# EAGLE design servoreference (EAGLE 6.0)
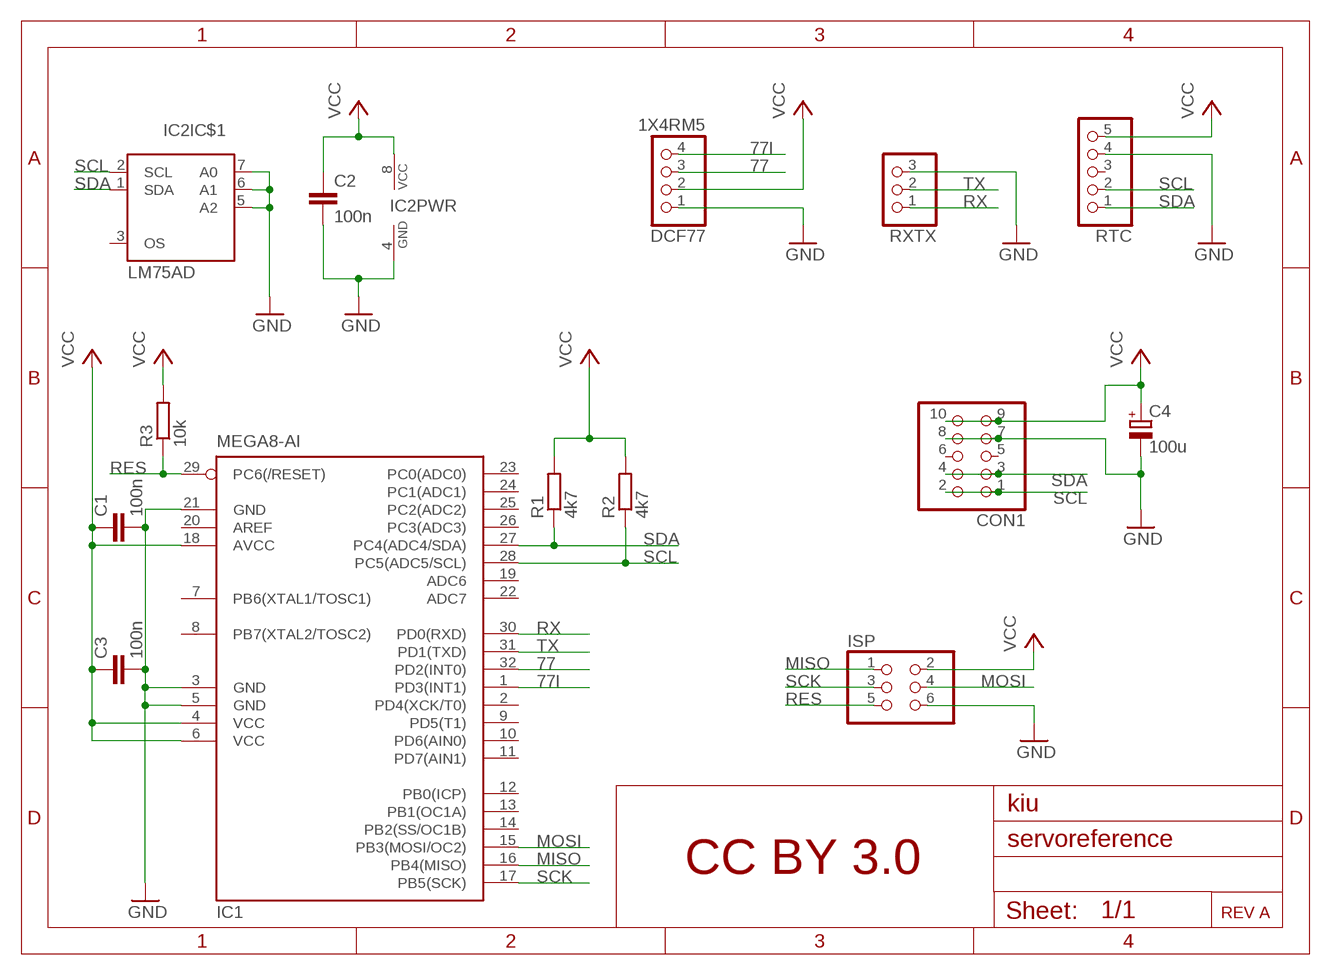
[diagram p0: schematic, sheet 1]

## Parts
C1  100n  C-EUC0805  [C0805]
C2  100n  C-EUC0805  [C0805]
C3  100n  C-EUC0805  [C0805]
C4  100u  CPOL-EU153CLV-0505  [153CLV-0505]
CON1  PINHD-2X5  [2X05]
DCF77  1X4RM5  [1X4RM5]
IC1  MEGA8-AI  [TQFP32-08]
IC2  LM75AD  [SO08]
ISP  PINHD-2X3  [2X03]
R1  4k7  R-EU_R0805  [R0805]
R2  4k7  R-EU_R0805  [R0805]
R3  10k  R-EU_R0805  [R0805]
RTC  PINHD-1X5  [1X05]
RXTX  PINHD-1X3  [1X03]

## Nets
77: DCF77.3 IC1.32(PD2(INT0))
77I: DCF77.4 IC1.1(PD3(INT1))
GND: C1.2 C2.2 C3.2 C4.- CON1.7 CON1.8 DCF77.1 IC1.3(GND) IC1.5(GND) IC1.21(GND) IC2.4(PWR:GND) IC2.5(IC$1:A2) IC2.6(IC$1:A1) IC2.7(IC$1:A0) ISP.6 RTC.4 RXTX.3
MISO: IC1.16(PB4(MISO)) ISP.1
MOSI: IC1.15(PB3(MOSI/OC2)) ISP.4
RES: IC1.29(PC6(/RESET)) ISP.5 R3.1
RX: IC1.30(PD0(RXD)) RXTX.1
SCK: IC1.17(PB5(SCK)) ISP.3
SCL: CON1.1 CON1.2 IC1.28(PC5(ADC5/SCL)) IC2.2(IC$1:SCL) R2.1 RTC.2
SDA: CON1.3 CON1.4 IC1.27(PC4(ADC4/SDA)) IC2.1(IC$1:SDA) R1.1 RTC.1
TX: IC1.31(PD1(TXD)) RXTX.2
VCC: C1.1 C2.1 C3.1 C4.+ CON1.9 CON1.10 DCF77.2 IC1.4(VCC) IC1.6(VCC) IC1.18(AVCC) IC2.8(PWR:VCC) ISP.2 R1.2 R2.2 R3.2 RTC.5
Unconnected: CON1.5 CON1.6 IC1.2(PD4(XCK/T0)) IC1.7(PB6(XTAL1/TOSC1)) IC1.8(PB7(XTAL2/TOSC2)) IC1.9(PD5(T1)) IC1.10(PD6(AIN0)) IC1.11(PD7(AIN1)) IC1.12(PB0(ICP)) IC1.13(PB1(OC1A)) IC1.14(PB2(SS/OC1B)) IC1.19(ADC6) IC1.20(AREF) IC1.22(ADC7) IC1.23(PC0(ADC0)) IC1.24(PC1(ADC1)) IC1.25(PC2(ADC2)) IC1.26(PC3(ADC3)) IC2.3(IC$1:OS) RTC.3

## Notes on the sheet
- kiu
- CC BY 3.0
- REV A

## Library data of the parts
C1-C3 = rcl:C-EU: CAPACITOR, European symbol
C4 = rcl:CPOL-EU: POLARIZED CAPACITOR, European symbol
CON1 = pinhead:PINHD-2X5: PIN HEADER
DCF77 = kiu:1X4RM5
IC1 = atmel:MEGA8: MICROCONTROLLER 8 Kbytes FLASH, 1 kbytes SRAM, 512 bytes EEPROM, USART, 6-channel 10 bit ADC, 2-channel 8 bit ADC Pin compatible with Atmega48, ATMega88, ATMega168 Source: avr.lbr; MPN: ATMEGA8-16AU; OC_FARNELL: 9171371; OC_NEWARK: 73M8863
IC2 = i2c:LM75AD: Digital Temperature Sensor and Thermal Watchdog
ISP = pinhead:PINHD-2X3: PIN HEADER
R1-R3 = rcl:R-EU_: RESISTOR, European symbol
RTC = pinhead:PINHD-1X5: PIN HEADER
RXTX = pinhead:PINHD-1X3: PIN HEADER

## Board
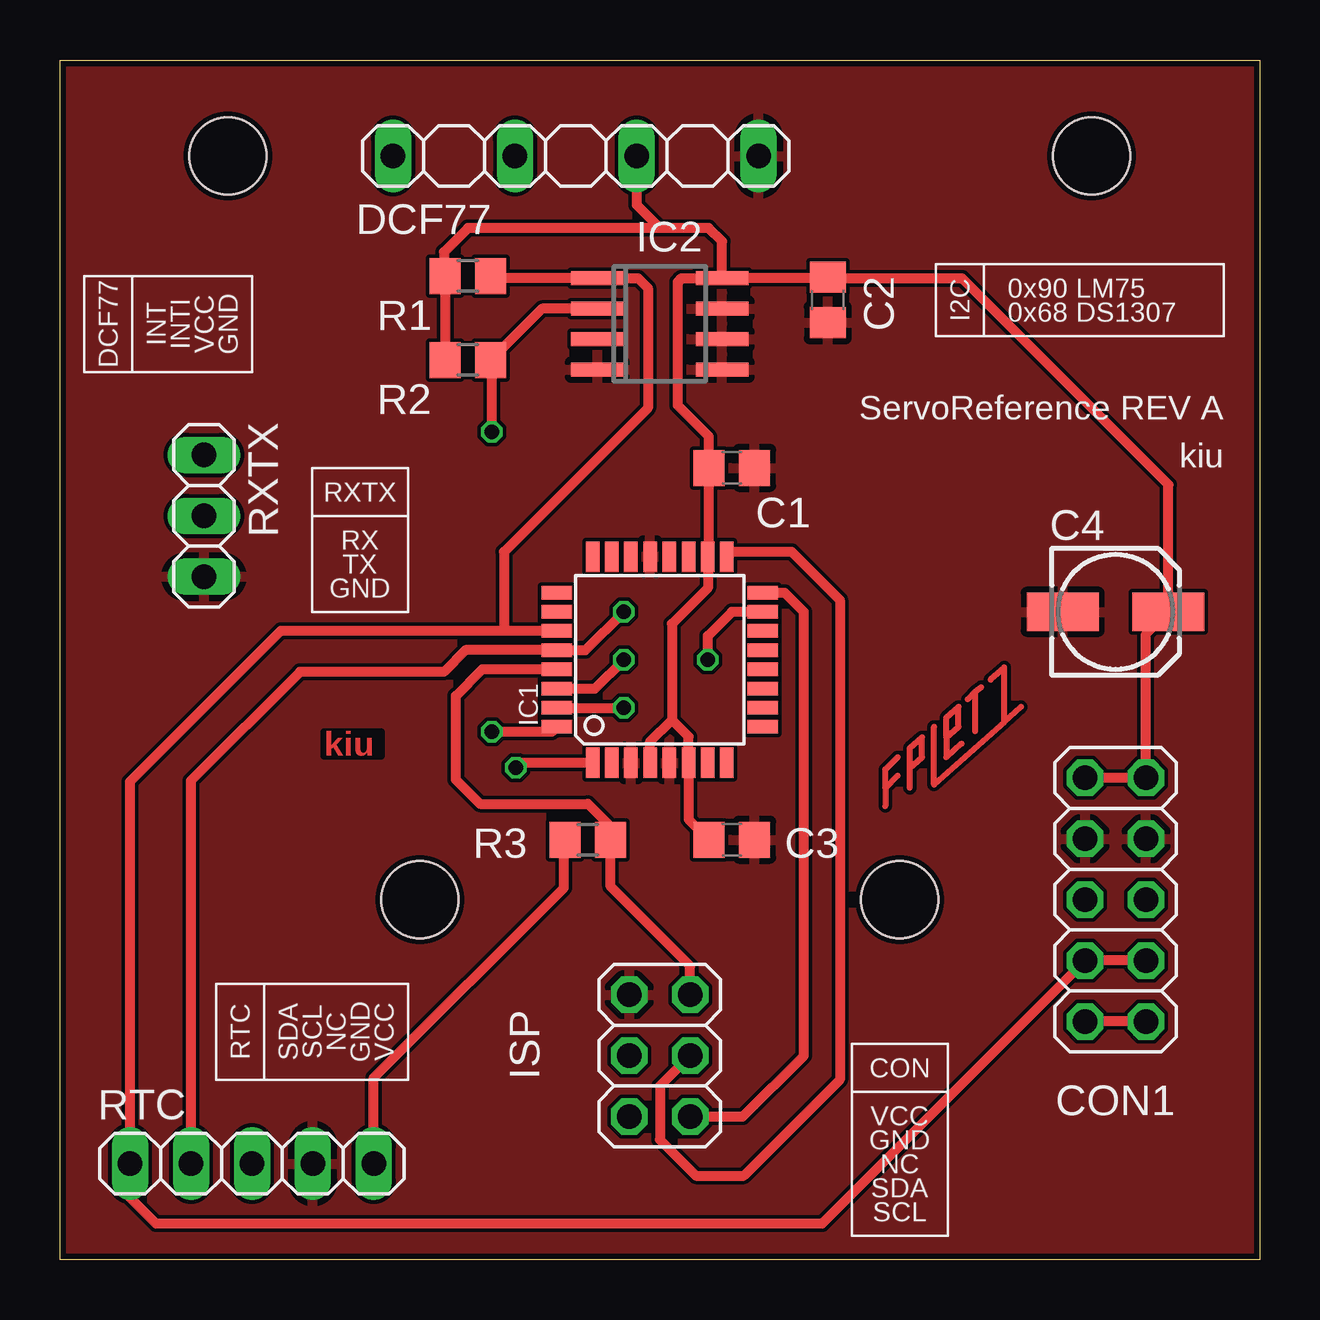
[diagram p1: board, top side]
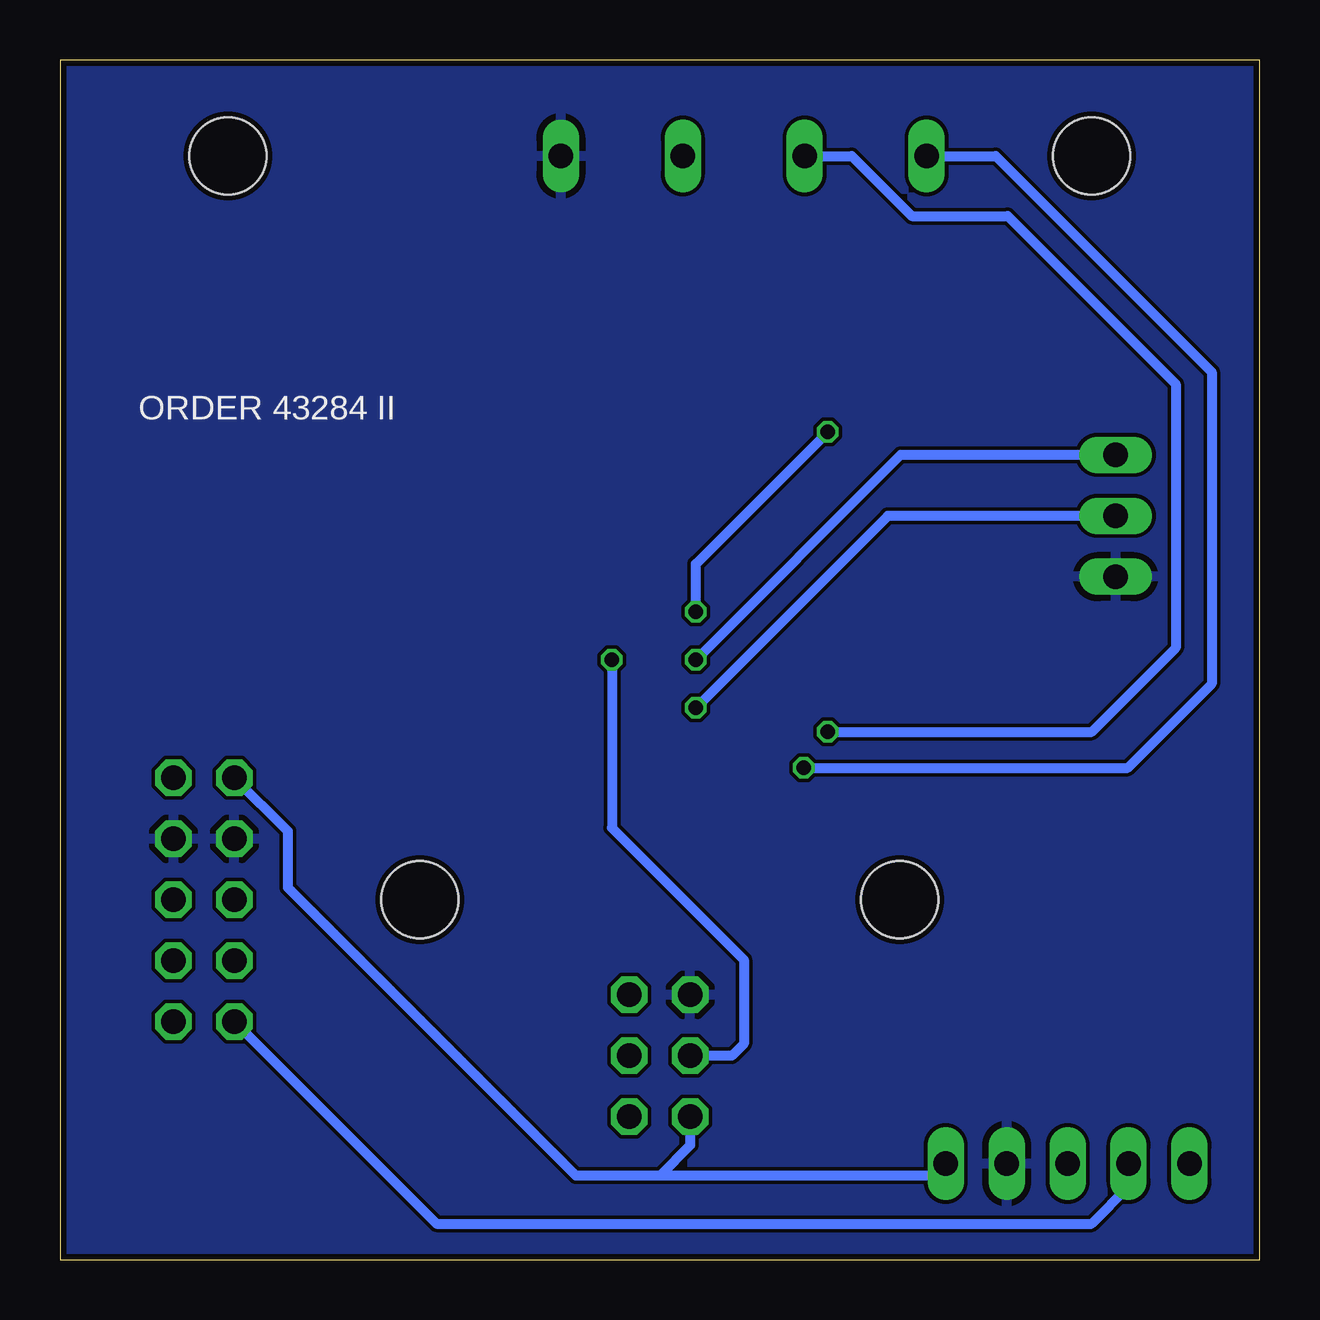
[diagram p2: board, bottom side, seen from below]

Size 50 x 50 mm. Coordinates in mm from the lower left corner, seen from the top.
Outline: 0,0 0,50 50,50 50,0 0,0
Copper layers (1*16): Top 0.035mm / dielectric 1.5mm / Bottom 0.035mm
Design rules: minimum track width 6mil, minimum drill 12mil, track to track 6mil, track to pad 6mil, pad to pad 6mil, via to via 6mil, smd to smd 0mil, copper to edge 10mil, drill to drill 10mil, minimum pad ring 10mil, minimum via ring 6mil, stop-mask expansion 2mil, vias tented up to drill 100mil, thermal gap 10mil
Holes 3.2 mm at 7,46 15,15 43,46 35,15

### Footprints (pad centres in the part's own frame; a part is rotated, then mirrored left to right if it is on the bottom)
C0805 = smd 1.3 x 1.5: 1 -0.95,0; 2 0.95,0
153CLV-0505 = smd 3 x 1.6: + 2.2,0; - -2.2,0
2X05 = drill 1.016 octagon: 1 -5.08,-1.27; 2 -5.08,1.27; 3 -2.54,-1.27; 4 -2.54,1.27; 5 0,-1.27; 6 0,1.27; 7 2.54,-1.27; 8 2.54,1.27; 9 5.08,-1.27; 10 5.08,1.27
1X4RM5 = drill 1.016 long: 1 -7.62,0; 2 -2.54,0; 3 2.54,0; 4 7.62,0
TQFP32-08 = smd 1.27 x 0.559: 1 -4.293,2.8; 2 -4.293,2; 3 -4.293,1.2; 4 -4.293,0.4; 5 -4.293,-0.4; 6 -4.293,-1.2; 7 -4.293,-2; 8 -4.293,-2.8; 17 4.293,-2.8; 18 4.293,-2; 19 4.293,-1.2; 20 4.293,-0.4; 21 4.293,0.4; 22 4.293,1.2; 23 4.293,2; 24 4.293,2.8 | smd 0.559 x 1.27: 9 -2.8,-4.293; 10 -2,-4.293; 11 -1.2,-4.293; 12 -0.4,-4.293; 13 0.4,-4.293; 14 1.2,-4.293; 15 2,-4.293; 16 2.8,-4.293; 25 2.8,4.293; 26 2,4.293; 27 1.2,4.293; 28 0.4,4.293; 29 -0.4,4.293; 30 -1.2,4.293; 31 -2,4.293; 32 -2.8,4.293
SO08 = smd 0.6 x 2.2: 1 -1.905,-2.6; 2 -0.635,-2.6; 3 0.635,-2.6; 4 1.905,-2.6; 5 1.905,2.6; 6 0.635,2.6; 7 -0.635,2.6; 8 -1.905,2.6
2X03 = drill 1.016 octagon: 1 -2.54,-1.27; 2 -2.54,1.27; 3 0,-1.27; 4 0,1.27; 5 2.54,-1.27; 6 2.54,1.27
R0805 = smd 1.3 x 1.5: 1 -0.95,0; 2 0.95,0
1X05 = drill 1.016 long: 1 -5.08,0; 2 -2.54,0; 3 0,0; 4 2.54,0; 5 5.08,0
1X03 = drill 1.016 long: 1 -2.54,0; 2 0,0; 3 2.54,0

### Placement (x,y rotation side)
C1  28,33 0 top
C2  32,40 270 top
C3  28,17.5 0 top
C4  44,27 0 top
CON1  44,15 90 top
DCF77  21.5,46 180 top
IC1  25,25 90 top
IC2  25,39 270 top
ISP  25,8.5 90 top
R1  17,41 180 top
R2  17,37.5 180 top
R3  22,17.5 180 top
RTC  8,4 0 top
RXTX  6,31 270 top

### Tracks (layer width: path | path; a pad name or v marks a point on that pad's centre or on a via)
77  (via drill 0.6)
  Top 0.406: IC1.32 20.51,22 v18,22
  Bottom 0.406: v18,22 7,22 3.5,25.5 3.5,36.5 10.5,43.5 14.5,43.5 17,46 DCF77.3
77I  (via drill 0.6)
  Top 0.406: IC1.1 19.29,20.71 v19,20.5
  Bottom 0.406: v19,20.5 5.5,20.5 2,24 2,37 11,46 DCF77.4
GND
  pour Top: -1,-1 51,-1 51,51 -1,51
  pour Bottom: -1,-1 51,-1 51,51 -1,51
MISO
  Top 0.406: IC1.16 30.2,27.8 31,27 31,8.5 28.46,5.96 ISP.1
MOSI  (via drill 0.6)
  Top 0.406: v27,25 27,26 28,27 IC1.15
  Bottom 0.406: v27,25 27,18 21.5,12.5 21.5,9 22,8.5 ISP.4
N$13
  Top 0.254: 35.42,20.49 35.42,21.32 35.93,21.76 35.93,20.94 35.42,20.49 | 35.42,19.67 35.42,20.49
N$14
  Top 0.254: 36.44,22.21 36.44,19.79 39.36,22.4 | 38.79,24.18 39.36,24.68 39.36,22.4 | 39.36,22.4 40.06,23.03
N$15
  Top 0.254: 37.58,21.51 36.94,20.94 36.94,21.76 | 36.94,21.76 36.94,22.59 37.45,23.03 37.45,22.21 36.94,21.76
N$16
  Top 0.254: 38.15,23.67 37.83,23.35 | 38.15,22.02 38.15,23.67 | 38.15,23.67 38.41,23.86
N$19
  Top 0.254: 34.91,20.94 34.4,20.43 34.4,19.67 | 34.4,19.67 34.4,18.9 | 34.4,19.67 34.91,20.17
RES
  Top 0.406: IC1.29 17.6,24.6 16.5,23.5 16.5,20 17.5,19 22,19 22.95,18.05 R3.1 22.95,15.55 26.27,12.23 ISP.5
RX  (via drill 0.6)
  Top 0.406: IC1.30 22.3,23.8 v23.5,25
  Bottom 0.406: v23.5,25 14.96,33.54 RXTX.1
SCK
  Top 0.406: ISP.3 25,7.23 25,5 26.5,3.5 28.5,3.5 32.5,7.5 32.5,27.5 30.5,29.5 28.01,29.5 IC1.17
SCL  (via drill 0.6)
  Top 0.406: CON1.1 CON1.2 | IC2.2 20.09,39.63 R2.1 18,37.45 v18,34.5 | v23.5,27 21.9,25.4 IC1.28 16.9,25.4 16,24.5 10,24.5 5.46,19.96 RTC.2
  Bottom 0.406: CON1.2 34.31,1.5 7,1.5 5.46,3.04 RTC.2 | v23.5,27 23.5,29 v18,34.5
SDA
  Top 0.406: CON1.3 CON1.4 31.77,1.5 4,1.5 2.92,2.58 RTC.1 2.92,19.92 9.2,26.2 18.5,26.2 | R1.1 18.05,40.91 IC2.1 24.09,40.91 24.5,40.5 24.5,35.5 18.5,29.5 18.5,26.2 | IC1.27 18.5,26.2
TX  (via drill 0.6)
  Top 0.406: IC1.31 v23.5,23
  Bottom 0.406: v23.5,23 15.5,31 RXTX.2
VCC
  Top 0.406: 31.95,40.91 C2.1 | IC2.8 27.6,42.44 27.04,43 25,43 | 31.95,40.91 IC2.8 | IC1.4 24.6,21.6 25.5,22.5 | R2.2 R1.2 16,41.05 16,42 17,43 25,43 | CON1.10 CON1.9 45.27,26.07 C4.+ 46.2,32.3 37.59,40.91 31.95,40.91 | 25.5,22.5 25.5,26.5 27,28 IC1.18 27.05,29.34 C1.1 27.05,34.3 25.75,35.6 25.75,40.75 25.91,40.91 IC2.8 | DCF77.2 24.04,43.96 25,43 | C3.1 26.2,18.35 IC1.6 26.2,21.8 25.5,22.5 | R3.2 21,17.45 21,15.5 13.08,7.58 RTC.5
  Bottom 0.406: 25,3.5 28.5,3.5 40.5,15.5 40.5,17.85 CON1.10 | ISP.2 23.73,4.77 25,3.5 | RTC.5 13.58,3.5 25,3.5

### Text on the board
Top: kiu
tNames: I2C | 0x68 DS1307 | 0x90 LM75 | DCF77 | INT | INTI | VCC | GND | ServoReference REV A | kiu | RXTX | RX | TX | GND | RTC | SDA | SCL | NC | GND | VCC | CON | VCC | GND | NC | SDA | SCL
bNames: ORDER 43284 II